# EAGLE design SparkFun_Qwiic_6DoF_BMI270 (EAGLE 9.6.2)
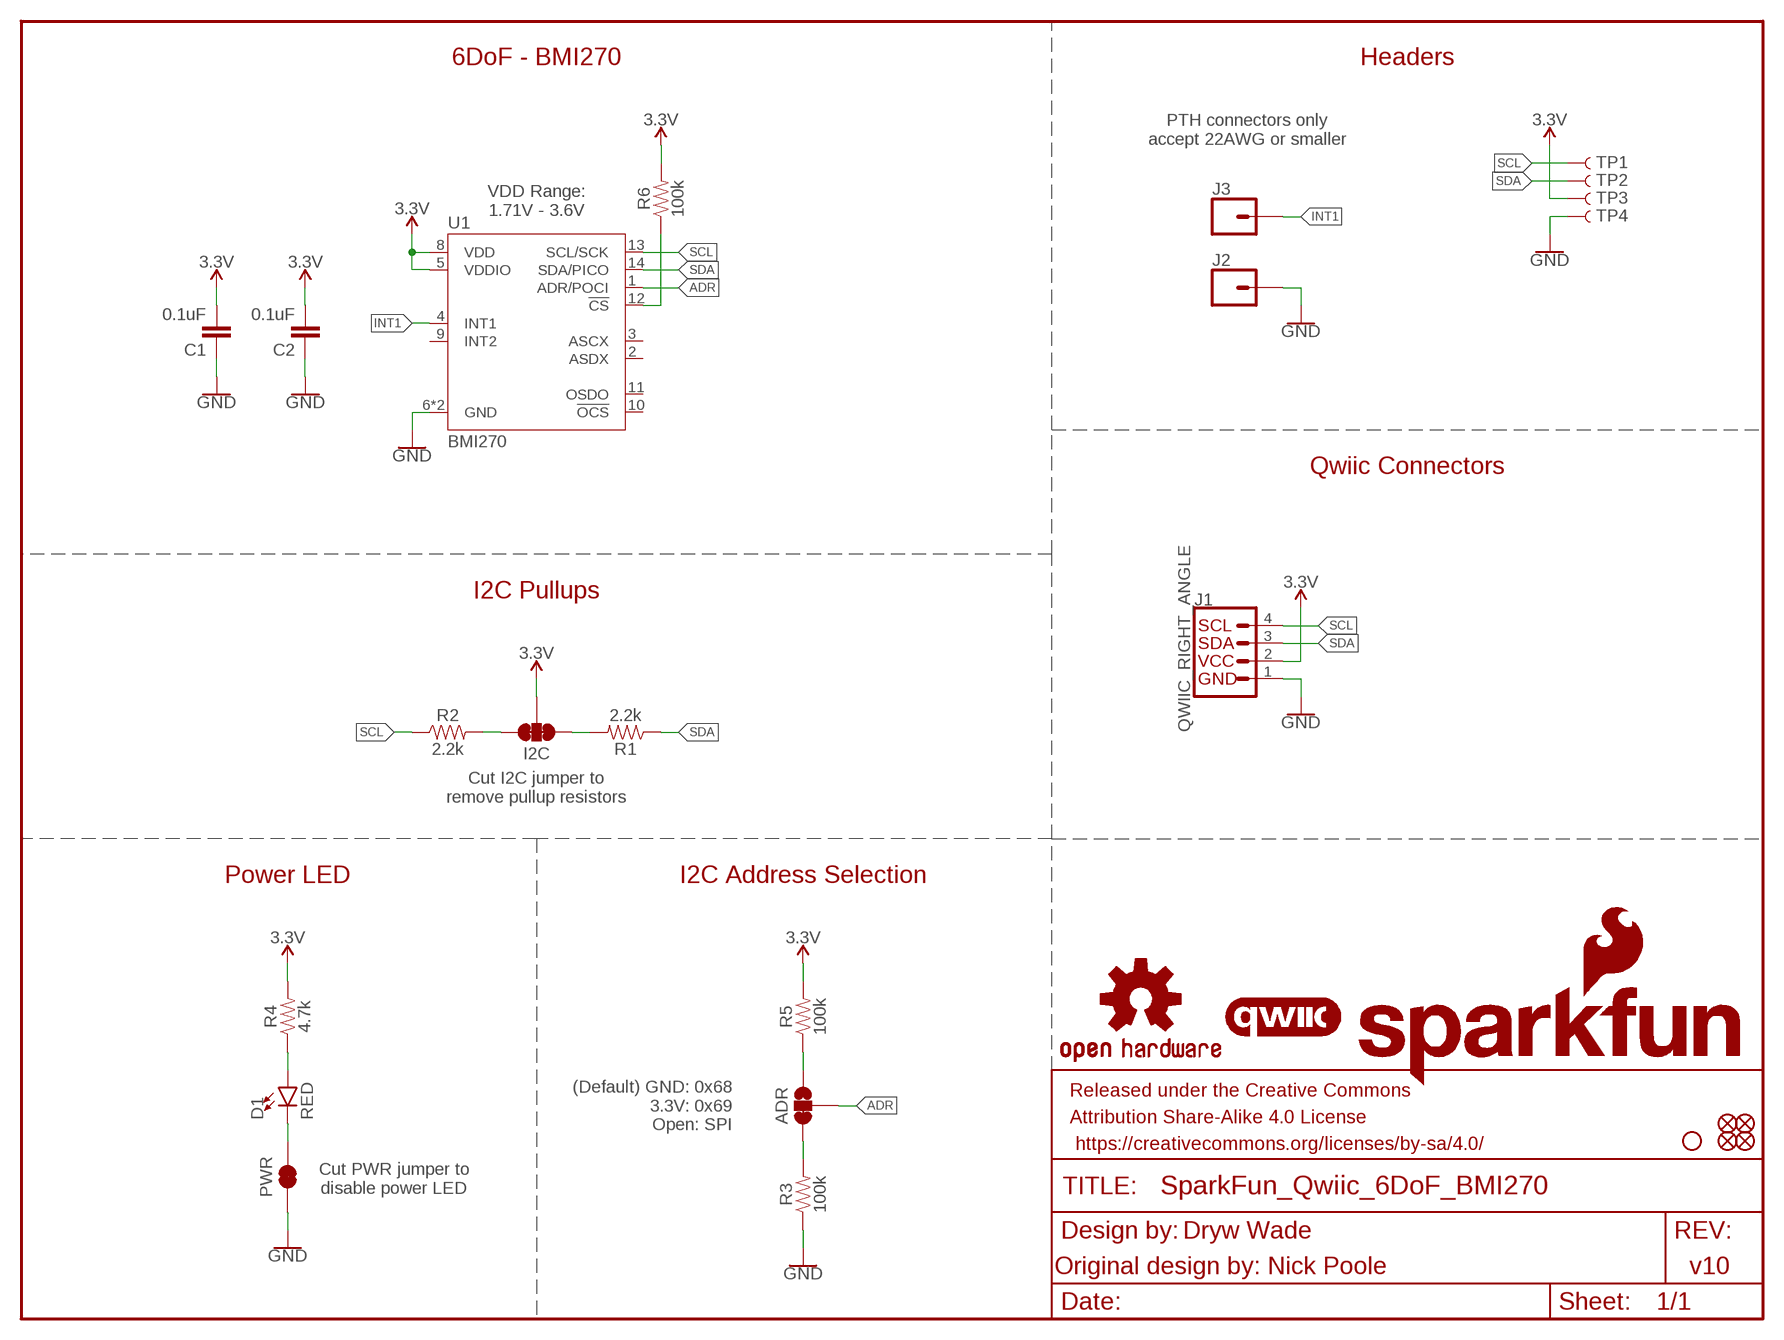
[diagram p0: schematic, sheet 1]

## Parts
ADR  JUMPER-SMT_3_1-NC_TRACE_SILK  [SMT-JUMPER_3_1-NC_TRACE_SILK]
C1  0.1uF  0.1UF-0402T-6.3V-10%-X7R  [0402-TIGHT]
C2  0.1uF  0.1UF-0402T-6.3V-10%-X7R  [0402-TIGHT]
D1  RED  LED-RED_0402  [LED-0402]
FD1  FIDUCIALUFIDUCIAL  [FIDUCIAL-MICRO]
FD2  FIDUCIALUFIDUCIAL  [FIDUCIAL-MICRO]
FD3  FIDUCIALUFIDUCIAL  [FIDUCIAL-MICRO]
FD4  FIDUCIALUFIDUCIAL  [FIDUCIAL-MICRO]
FRAME1  FRAME-LETTER  [CREATIVE_COMMONS]
H1  STAND-OFF  [STAND-OFF]
I2C  JUMPER-SMT_3_2-NC_TRACE_SILK  [SMT-JUMPER_3_2-NC_TRACE_SILK]
J1  QWIIC_RIGHT_ANGLE  QWIIC_CONNECTORJS-1MM  [JST04_1MM_RA]
J2  CONN_01_1MM  [1X01_1MM_NO_SILK]
J3  CONN_01_1MM  [1X01_1MM_NO_SILK]
LOGO1  SFE_LOGO_NAME_FLAMEBLANK  [BLANK]
LOGO2  QWIIC_LOGO_3MM  [QWIIC_3MM]
LOGO3  OSHW-LOGOMINI  [OSHW-LOGO-MINI]
PWR  JUMPER-SMT_2_NC_TRACE_SILK  [SMT-JUMPER_2_NC_TRACE_SILK]
R1  2.2k  2.2KOHM-0402T-1/16W-1%  [0402-TIGHT]
R2  2.2k  2.2KOHM-0402T-1/16W-1%  [0402-TIGHT]
R3  100k  100KOHM-0402T-1/16W-1%  [0402-TIGHT]
R4  4.7k  4.7KOHM-0402T-1/16W-1%  [0402-TIGHT]
R5  100k  100KOHM-0402T-1/16W-1%  [0402-TIGHT]
R6  100k  100KOHM-0402T-1/16W-1%  [0402-TIGHT]
TP1  TEST-POINT3  [PAD.03X.03]
TP2  TEST-POINT3  [PAD.03X.03]
TP3  TEST-POINT3  [PAD.03X.03]
TP4  TEST-POINT3  [PAD.03X.03]
U1  BMI270  [BMI270]

## Nets
3.3V: C1.2 C2.2 I2C.2 J1.2 R4.2 R5.2 R6.2 TP3.1 U1.5(VDDIO) U1.8(VDD)
ADR: ADR.2 U1.1(ADR/POCI)
GND: C1.1 C2.1 J1.1 J2.1 PWR.1 R3.1 TP4.1 U1.6(GND) U1.7(GND)
INT1: J3.1 U1.4(INT1)
N$1: I2C.1 R1.2
N$2: I2C.3 R2.2
N$3: D1.C PWR.2
N$4: D1.A R4.1
N$5: ADR.1 R5.1
N$6: ADR.3 R3.2
N$7: R6.1 U1.12(!CS!)
SCL: J1.4 R2.1 TP1.1 U1.13(SCL/SCK)
SDA: J1.3 R1.1 TP2.1 U1.14(SDA/PICO)
Unconnected: U1.2(ASDX) U1.3(ASCX) U1.9(INT2) U1.10(!OCS!) U1.11(OSDO)

## Notes on the sheet
- 6DoF - BMI270 | Headers
- PTH connectors only
  accept 22AWG or smaller
- VDD Range:
  1.71V - 3.6V
- Qwiic Connectors
- I2C Pullups
- Cut I2C jumper to
  remove pullup resistors
- Power LED | I2C Address Selection
- (Default) GND: 0x68
  3.3V: 0x69
  Open: SPI
- Cut PWR jumper to
  disable power LED
- Dryw Wade
- Original design by: Nick Poole | v10

## Library data of the parts
ADR = SparkFun-Jumpers:JUMPER-SMT_3_1-NC_TRACE: Normally closed trace jumper (1 of 2 connections) This jumper has a trace between two pads so it's normally closed (NC). The other connection is normally open (NO). Use a razor knife to open the connection. For best results follow the IPC guidelines for cutting traces: Cutout at least 0.063 mm (0.005 in). Remove all loose material to clean up the cut area. Seal the cut with an approved epoxy. Reapply solder to reclose the connection, or to close the NO connection.
C1 C2 = SparkFun-Capacitors:0.1UF: 0.1µF ceramic capacitors A capacitor is a passive two-terminal electrical component used to store electrical energy temporarily in an electric field.; PROD_ID: CAP-14993
D1 = SparkFun-LED:LED-RED: Red SMD LED Used in manufacturing of most products at SparkFun Packages: 0603 - KB - KingBright (DIO-17976) SMD 0603 package [Datasheet] <https://www.kingbrightusa.com/images/catalog/SPEC/APT1608SURCK.pdf> 0603 - (DIO-00819, has gone EOL) SMD 0603 package 0603 SMART - SMD 0603 SMART package ( more efficient and expensive)[Product Link] <http://www.osram-os.com/Graphics/XPic2/00077099_0.pdf> 1206 - SMD1206 package [Product Link] <https://www.sparkfun.com/datasheets/DevTools/LilyPad/Q150OVS4.pdff> SparkFun Products: Pro Mini 328 -5V <https://www.sparkfun.com/products/821> RedBoard <https://www.sparkfun.com/products/12757> IOIO-OTG <https://www.sparkfun.com/products/13613>; PROD_ID: DIO-16757
FD1-FD4 = SparkFun-Aesthetics:FIDUCIAL: Fiducial Alignment Points Point-of-reference for pick-and-place machines and other optical instruments.
FRAME1 = SparkFun-Aesthetics:FRAME-LETTER: Schematic Frame - Letter Standard 8.5x11 US Letter frame
H1 = SparkFun-Hardware:STAND-OFF: Stand Off Drill holes for mechanically mounting via screws, standoffs, etc. Note: Use the keepout ring to avoid running the screw head into surrounding components. Variant Overviews STAND-OFF - Mechanical footprint for a #4 phillips button head screw. STAND-OFF-TIGHT - Mechanical footprint for a #4 phillips button head screw, Example SparkFun Products Screw - Phillips Head (1/4", 4-40, 10 pack) <https://www.sparkfun.com/products/10453> (PRT-10453) Screw - Phillips Head (1/2", 4-40, 10 pack) <https://www.sparkfun.com/products/10452> (PRT-10452) Screw - Phillips Head (3/4", 4-40, 10 pack) <https://www.sparkfun.com/products/10451> (PRT-10451) Screw - Phillips Head (1", 4-40, 10 pack) <https://www.sparkfun.com/products/10450> (PRT-10450)
I2C = SparkFun-Jumpers:JUMPER-SMT_3_2-NC_TRACE: Normally closed trace jumper (2 of 2 connections) This jumper has a trace between all three pads so they are normally closed (NC). Use a razor knife to open the connection(s). For best results follow the IPC guidelines for cutting traces: Cutout at least 0.063 mm (0.005 in). Remove all loose material to clean up the cut area. Seal the cut with an approved epoxy. Reapply solder to reclose the connection(s).
J1 = SparkFun-Connectors:QWIIC_CONNECTOR: SparkFun I2C Standard Qwiic Connector An SMD 1mm pitch JST connector makes it easy and quick (get it? Qwiic?) to connect I2C devices to each other. The Qwiic system <http://www.sparkfun.com/qwiic> enables fast and solderless connection between popular platforms and various sensors and actuators. We carry 200mm <https://www.sparkfun.com/products/14204>, 100mm <https://www.sparkfun.com/products/14205>, 50mm <https://www.sparkfun.com/products/14206>, and breadboard friendly <https://www.sparkfun.com/products/14207> Qwiic cables. We also offer 10 pcs strips <https://www.sparkfun.com/products/14323> the SMD connectors.; PROD_ID: CONN-13694
J2 J3 = SparkFun-Connectors:CONN_01: Single connection point. Often used as Generic Header-pin footprint for 0.1 inch spaced/style header connections On any of the 0.1 inch spaced packages, you can populate with these: Break Away Headers - Straight <https://www.sparkfun.com/products/116> (PRT-00116) Break Away Male Headers - Right Angle <https://www.sparkfun.com/products/553> (PRT-00553) Female Headers <https://www.sparkfun.com/products/115> (PRT-00115) Break Away Headers - Machine Pin <https://www.sparkfun.com/products/117> (PRT-00117) Break Away Female Headers - Swiss Machine Pin <https://www.sparkfun.com/products/743> (PRT-00743) This device is also useful as a general connection point to wire up your design to another part of your project. Our various solder wires solder well into these plated through hole pads. Hook-Up Wire - Assortment (Stranded, 22 AWG) <https://www.sparkfun.com/products/11375> (PRT-11375) Hook-Up Wire - Assortment (Solid Core, 22 AWG) <https://www.sparkfun.com/products/11367> (PRT-11367) View the entire wire category on our website here <https://www.sparkfun.com/categories/141> Special notes: SMTSO-256-ET is a "flush mount" nut for a 4-40 screw. We mostly use this on specialty testbeds; it is a nice way to connect hardware to your PCB at an adjustable hieght. Also note, the SNAP packages are for using a snappable style connector. We sell a baggie of snaps and they are also used on two LilyPad designs: Snap Assortment - 30 pack (male and female) <https://www.sparkfun.com/products/11347> (DEV-11347) LilyPad Arduino SimpleSnap <https://www.sparkfun.com/products/10941> (DEV-10941) LilyPad SimpleSnap Protoboard <https://www.sparkfun.com/products/10940> (DEV-10940)
LOGO1 = SparkFun-Aesthetics:SFE_LOGO_NAME_FLAME: SparkFun Font Logo w/ Flame This is the SparkFun full logo. The logo on the schematic will always be the same size; the package variant is the height of the flame part of the logo. Default layer for the logo on the board is tSilk.
LOGO2 = SparkFun-Aesthetics:QWIIC_LOGO: Qwiic Logos for placement on schematic and PCB. The 5.5mm silk logo is best for placing next to Qwiic connector.
LOGO3 = SparkFun-Aesthetics:OSHW-LOGO: Open-Source Hardware (OSHW) Logo This logo indicates the piece of hardware it is found on incorporates a OSHW license and/or adheres to the definition of open source hardware found here: http://freedomdefined.org/OSHW
PWR = SparkFun-Jumpers:JUMPER-SMT_2_NC_TRACE: Normally closed trace jumper This jumper has a trace between two pads so it's normally closed (NC). Use a razor knife to open the connection. For best results follow the IPC guidelines for cutting traces: Cutout at least 0.063 mm (0.005 in). Remove all loose material to clean up the cut area. Seal the cut with an approved epoxy. Reapply solder to reclose the connection.
R1 R2 = SparkFun-Resistors:2.2KOHM: 2.2kΩ resistor A resistor is a passive two-terminal electrical component that implements electrical resistance as a circuit element. Resistors act to reduce current flow, and, at the same time, act to lower voltage levels within circuits. - Wikipedia; PROD_ID: RES-14341
R3 R5 R6 = SparkFun-Resistors:100KOHM: 100kΩ resistor A resistor is a passive two-terminal electrical component that implements electrical resistance as a circuit element. Resistors act to reduce current flow, and, at the same time, act to lower voltage levels within circuits. - Wikipedia; PROD_ID: RES-13495
R4 = SparkFun-Resistors:4.7KOHM: 4.7kΩ resistor A resistor is a passive two-terminal electrical component that implements electrical resistance as a circuit element. Resistors act to reduce current flow, and, at the same time, act to lower voltage levels within circuits. - Wikipedia; PROD_ID: RES-15343
TP1-TP4 = SparkFun-Connectors:TEST-POINT: SparkFun Test Points Bare copper test points for troubleshooting or In-Circuit-Testing. These are used by our Production team for verifying production board runs using pogo-pins on test beds. SparkFun Products: SparkFun LSM9DS1 Breakout <https://www.sparkfun.com/products/13284> SparkFun PSOC <https://www.sparkfun.com/products/13714> SparkFun Load Cell Amplifier <https://www.sparkfun.com/products/13879>
U1 = BMI270:BMI270; PROD_ID: IC-15423

## Board
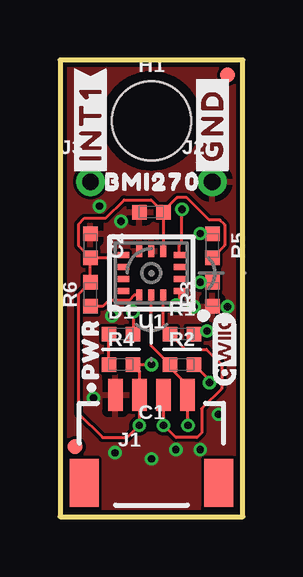
[diagram p1: board, top side]
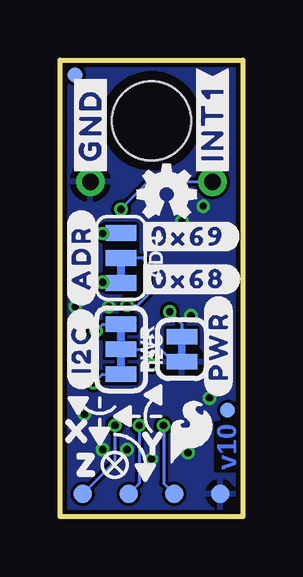
[diagram p2: board, bottom side, seen from below]

Size 7.62 x 19.05 mm. Coordinates in mm from the lower left corner, seen from the top.
Outline: 0,0 7.62,0 7.62,19.05 0,19.05 0,0
Copper layers (1*16): Top 0.035mm / dielectric 1.5mm / Bottom 0.035mm
Design rules "SparkFun-2-Layer-Minimum-JLCPCB": minimum track width 5mil, minimum drill 0.3mm, track to track 5mil, track to pad 5mil, pad to pad 5mil, via to via 5mil, smd to smd 5mil, copper to edge 7mil, drill to drill 7mil, minimum pad ring 5mil, minimum via ring 5mil, stop-mask expansion 2.5mil, vias tented up to drill 25mil, thermal gap 10mil
tRestrict: area 3.5,10.9 to 3.6,11.2; area 6.3,10.2 to 6.6,10.4; area 3.7,3.7 to 3.9,3.9; area 2.4,7.6 to 2.7,7.9; area 3.2,10.5 to 3.9,10.8
bRestrict: area 4.4,11.2 to 5.7,11.4; area 5.3,10.2 to 5.7,10.4

### Footprints (pad centres in the part's own frame; a part is rotated, then mirrored left to right if it is on the bottom)
SMT-JUMPER_3_1-NC_TRACE_SILK = smd 0.66 x 1.27: 1 -1.041,0; 2 0,0; 3 1.041,0
0402-TIGHT = smd 0.6 x 0.6: 1 -0.5,0; 2 0.5,0
LED-0402 = smd 0.6 x 0.6: A -0.5,0; C 0.5,0
FIDUCIAL-MICRO = smd 0.635 x 0.635: 1 0,0
STAND-OFF = hole 3.302: 0,0
SMT-JUMPER_3_2-NC_TRACE_SILK = smd 0.66 x 1.27: 1 -1.041,0; 2 0,0; 3 1.041,0
JST04_1MM_RA = smd 0.6 x 1.35: 1 -1.5,0; 2 -0.5,0; 3 0.5,0; 4 1.5,0 | smd 1.2 x 2: NC1 2.8,-3.675; NC2 -2.8,-3.675
1X01_1MM_NO_SILK = drill 0.7 pad 1.2: 1 0,0
SMT-JUMPER_2_NC_TRACE_SILK = smd 0.66 x 1.27: 1 -0.521,0; 2 0.521,0
PAD.03X.03 = smd 0.762 x 0.762: 1 0,0
BMI270 = smd 0.475 x 0.25: 1 -1.163,0.75; 2 -1.163,0.25; 3 -1.163,-0.25; 4 -1.163,-0.75; 8 1.163,-0.75; 9 1.163,-0.25; 10 1.163,0.25; 11 1.163,0.75 | smd 0.25 x 0.475: 5 -0.5,-0.912; 6 0,-0.912; 7 0.5,-0.912; 12 0.5,0.912; 13 0,0.912; 14 -0.5,0.912

### Placement (x,y rotation side)
ADR  5.08,10.79 270 bottom
C1  3.81,12.7 0 top
C2  1.27,11.3 270 top
D1  2.54,7.62 0 top
FD1  0.64,2.92 0 top
FD2  6.99,18.41 0 top
FD3  6.99,18.41 0 bottom
FD4  0.64,4.45 0 bottom
FRAME1  -19.05,-13.97 0 top  (outside the outline)
H1  3.81,16.51 0 top
I2C  5.08,6.99 270 bottom
J1  3.81,5.08 0 top
J2  6.35,13.97 0 top
J3  1.27,13.97 0 top
LOGO1  -21.59,-13.97 0 bottom  (outside the outline)
LOGO2  6.86,6.99 90 top
LOGO3  3.17,13.46 0 bottom
PWR  2.54,6.99 90 bottom
R1  5.08,7.62 0 top
R2  5.08,6.35 0 top
R3  6.35,9.27 90 top
R4  2.54,6.35 0 top
R5  6.35,11.3 270 top
R6  1.27,9.27 90 top
TP1  6.67,0.95 0 bottom
TP2  4.76,0.95 0 bottom
TP3  2.86,0.95 0 bottom
TP4  0.95,0.95 0 bottom
U1  3.81,10.16 180 top
U$1  [#I2C#0]  6.73,6.99 90 bottom
U$2  [#GND#0]  6.35,14.1 90 top
U$3  [SFE_LOGO_FLAME_.1]  2.16,3.56 0 bottom
U$4  [#PWR#0]  1.02,7.11 90 bottom
U$5  [#ADR#0]  6.73,10.79 90 bottom
U$6  [#0X68#0]  4.45,9.91 0 bottom
U$7  [#GND#0]  6.35,14.1 90 bottom
U$8  [#INT1#0]  1.27,14.1 90 top
U$9  [#INT1#0]  1.27,14.1 90 bottom
U$18  [#0X69#0]  4.45,11.68 0 bottom
U$21  [BMI2700]  3.86,13.97 0 top
U$33  [ORDERING_INSTRUCTIONS]  15.24,50.8 0 top  (outside the outline)
U$34  [PWR0]  1.27,6.99 90 top
U$79  [X0]  6.86,3.56 0 bottom
U$80  [Y0]  3.68,3.05 0 bottom
U$81  [Z0]  6.48,2.16 0 bottom

### Tracks (layer width: path | path; a pad name or v marks a point on that pad's centre or on a via)
3.3V  (via drill 0.3)
  Top 0.127: C1.2 U1.5 | R5.2 6.86,11.31 6.86,12.18 6.66,12.38 6.21,12.38 5.28,13.31 4.87,13.31 4.31,12.75 C1.2 | v3.81,6.35 R4.2 3.31,6.08 J1.2 v3.31,3.82 v3.3,3.81 2.79,3.3 1.78,3.3 0.76,4.32 0.76,9.26 R6.2 C2.2 | C1.2 3.8,13.21 2.67,13.21 1.91,12.45 1.02,12.45 0.76,12.19 0.76,11.31 C2.2 | C2.2 2.03,10.8 2.14,10.91 U1.8
  Bottom 0.127: v3.3,3.81 3.3,1.4 TP3.1 | I2C.2 4.06,6.99 3.81,6.73 v3.81,6.35
ADR  (via drill 0.3)
  Top 0.127: U1.1 4.97,8.96 v4.83,8.81
  Bottom 0.127: v4.83,8.81 4.39,8.81 3.94,9.27 3.94,10.54 4.19,10.79 ADR.2
GND  (via drill 0.3)
  Top 0.127: U1.7
  Bottom 0.127: PWR.1 2.79,6.72 3.16,6.72 3.56,7.11
  other vias: 1.4,4.95 2.54,12.32 2.16,8.38 3.81,2.41 4.83,2.79 5.84,2.79 2.29,2.67 5.59,8.76 6.99,8.76 6.6,4.27 1.65,12.95
  pour Top (isolate 0.127): 0,0 7.62,0 7.62,19.05 0,19.05
  pour Bottom (isolate 0.127): 0,0 7.62,0 7.62,19.05 0,19.05
INT1  (via drill 0.3)
  Top 0.127: U1.4 4.97,11.32 5.08,11.43 v5.08,12.83
  Bottom 0.127: v5.08,12.83 3.94,13.97 J3.1
N$1  (via drill 0.3)
  Top 0.127: R1.2 5.71,7.75 v6.12,7.75
  Bottom 0.127: v6.12,7.75 5.84,8.03 I2C.1
N$2  (via drill 0.3)
  Top 0.127: R2.2 6.22,5.71 v6.22,5.59
  Bottom 0.127: v6.22,5.59 5.87,5.94 I2C.3
N$3  (via drill 0.3)
  Top 0.127: D1.C v3.05,8.55
  Bottom 0.127: v3.05,8.55 2.54,8.05 PWR.2
N$4
  Top 0.127: R4.1 D1.A
N$5  (via drill 0.3)
  Top 0.127: R5.1 v5.85,11.8 v5.84,11.81
  Bottom 0.127: ADR.1 5.82,11.84 v5.84,11.81
N$6  (via drill 0.3)
  Top 0.127: R3.2 v5.85,9.77 v5.84,9.78
  Bottom 0.127: ADR.3 5.82,9.75 v5.84,9.78
N$7
  Top 0.127: U1.12 3.1,9.25 2.88,9.03 2.03,9.03 1.78,8.77 R6.1
SCL  (via drill 0.3)
  Top 0.127: v5.33,3.81 5.31,3.83 J1.4 5.31,5.49 4.58,6.22 R2.1 3.81,7.12 U1.13
  Bottom 0.127: v5.33,3.81 5.33,2.29 TP1.1
SDA  (via drill 0.3)
  Top 0.127: J1.3 v4.31,3.82 v4.32,3.81 4.83,3.3 5.71,3.3 5.91,3.49 5.91,4.51 6.73,5.33 6.73,6.35 6.1,6.99 5.21,6.99 R1.1 4.31,7.89 U1.14
  Bottom 0.127: v4.32,3.81 4.32,1.4 TP2.1

### Text on the board
Bottom: v10
Measures: Units: inches
tDocu: Solder Mask: Red / Thickness: 1.6mm / Two layer design / Finish: Lead Free HASL | Dryw Wade | Original design by: Nick Poole